# Altium schematic sheet Sensors.SchDoc
size A3; Organization: Altium Limited; Address1: L3, 12a Rodborough Rd; Address2: Frenchs Forest; Address3: NSW; Address4: Australia 2086
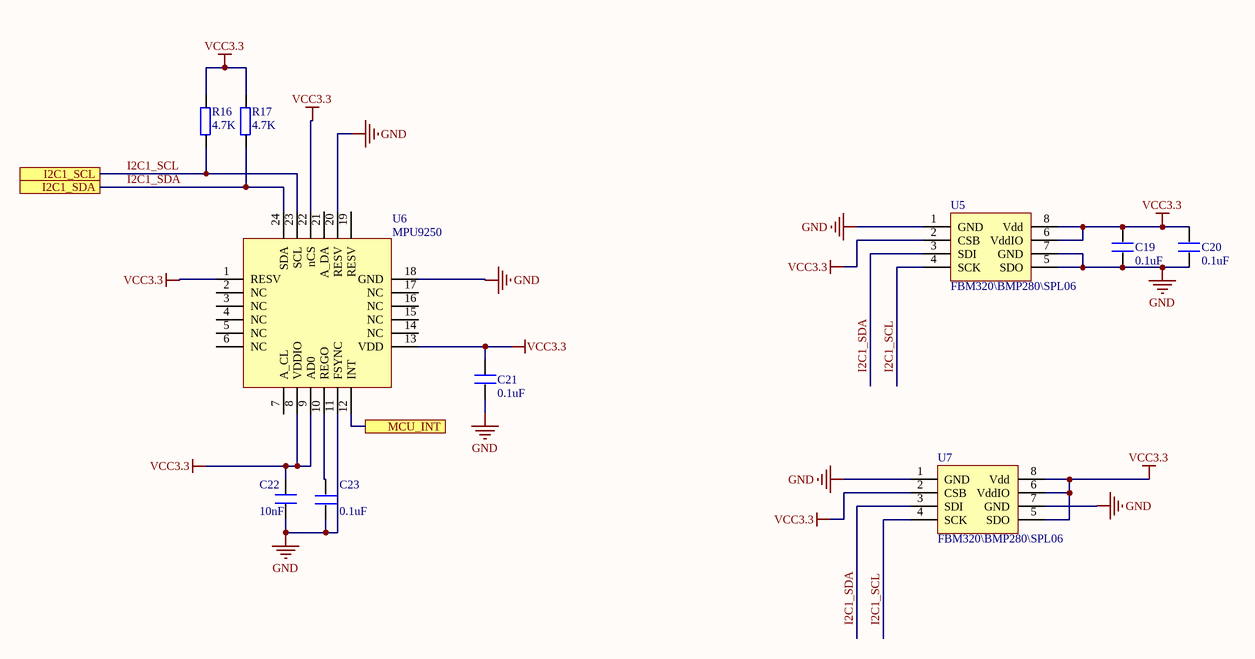
[diagram p0: Sensors.SchDoc]

## Parts
C19  0.1uF  [0603P]
C20  0.1uF  [0603P]
C21  0.1uF  [0603P]
C22  10nF  [0603P]
C23  0.1uF  [0603P]
R16  4.7K  [0603P]
R17  4.7K  [0603P]
U5  FBM320\BMP280\SPL06  [LGA-2_5X2MM]
U6  MPU9250  [QFN24-0.4]
U7  FBM320\BMP280\SPL06  [LGA-2_5X2MM]

## Ports
I2C1_SCL, I2C1_SDA, MCU_INT

## Nets
GND: C19.1 C20.1 C21.1 C22.1 C23.2 U5.1(GND) U5.5(SDO) U5.7(GND) U6.11(FSYNC) U6.18(GND) U6.20(RESV) U7.1(GND) U7.7(GND)
VCC3.3: C19.2 C20.2 C21.2 C22.2 R16.1 R17.1 U5.2(CSB) U5.6(VddIO) U5.8(Vdd) U6.1(RESV) U6.8(VDDIO) U6.9(AD0) U6.13(VDD) U6.22(nCS) U7.2(CSB) U7.5(SDO) U7.6(VddIO) U7.8(Vdd)
I2C1_SCL: R16.2 U5.4(SCK) U6.23(SCL) U7.4(SCK) ; port I2C1_SCL
I2C1_SDA: R17.2 U5.3(SDI) U6.24(SDA) U7.3(SDI) ; port I2C1_SDA
MCU_INT: U6.12(INT) ; port MCU_INT
NetC23_1: C23.1 U6.10(REGO)

Not connected (* = marked no-connect by the designer): U6 2(NC) 3(NC) 4(NC) 5(NC) 6(NC) 7(A_CL) 14(NC) 15(NC) 16(NC) 17(NC) 19(RESV) 21(A_DA)

## Notes on the sheet
- Title
- Size:
- Date:
- A3
- Number:
- Time:
- Revision:
- Sheet
- of
- File:

## Library data of the parts
C19-C23 = C
R16 R17 = R
U5 U7 = FBM320: 气压计; Published: 8-August-2017; Publisher: mazhongwei; PackageReference: LGA-2_5X2MM